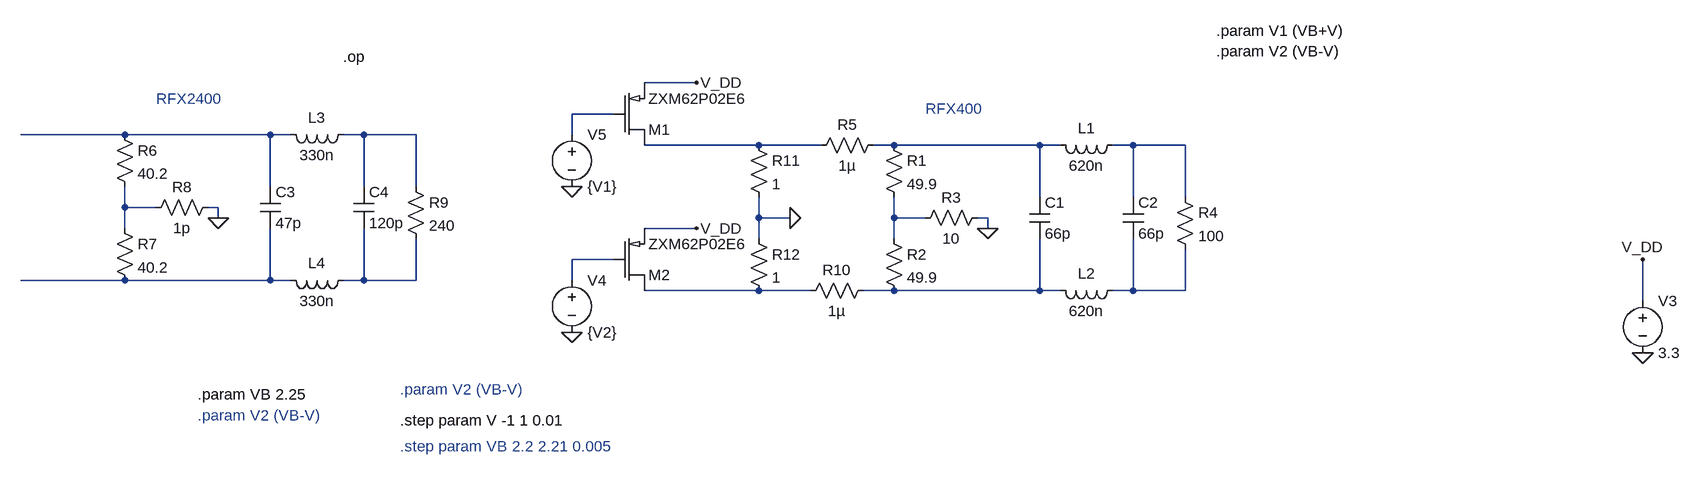
[diagram p0: schematic tr-RFX.asc]
tr-RFX.asc, the LTspice schematic file:
Version 4
SHEET 1 1008 760
WIRE -512 48 -592 48
WIRE -640 96 -704 96
WIRE -1392 128 -1552 128
WIRE -1168 128 -1392 128
WIRE -1136 128 -1168 128
WIRE -1024 128 -1056 128
WIRE -944 128 -1024 128
WIRE -704 128 -704 96
WIRE -416 144 -592 144
WIRE -320 144 -416 144
WIRE -208 144 -240 144
WIRE 16 144 -208 144
WIRE 48 144 16 144
WIRE 160 144 128 144
WIRE 240 144 160 144
WIRE -1168 208 -1168 128
WIRE -1024 208 -1024 128
WIRE -944 208 -944 128
WIRE 16 224 16 144
WIRE 160 224 160 144
WIRE 240 224 240 144
WIRE -1392 240 -1392 208
WIRE -1344 240 -1392 240
WIRE -1248 240 -1264 240
WIRE -1248 256 -1248 240
WIRE -416 256 -416 224
WIRE -368 256 -416 256
WIRE -208 256 -208 224
WIRE -160 256 -208 256
WIRE -64 256 -80 256
WIRE -1392 272 -1392 240
WIRE -512 272 -592 272
WIRE -64 272 -64 256
WIRE -416 288 -416 256
WIRE -208 288 -208 256
WIRE -640 320 -704 320
WIRE -1392 352 -1552 352
WIRE -1168 352 -1168 272
WIRE -1168 352 -1392 352
WIRE -1136 352 -1168 352
WIRE -1024 352 -1024 272
WIRE -1024 352 -1056 352
WIRE -944 352 -944 288
WIRE -944 352 -1024 352
WIRE -704 352 -704 320
WIRE -416 368 -592 368
WIRE -336 368 -416 368
WIRE -208 368 -256 368
WIRE 16 368 16 288
WIRE 16 368 -208 368
WIRE 48 368 16 368
WIRE 160 368 160 288
WIRE 160 368 128 368
WIRE 240 368 240 304
WIRE 240 368 160 368
WIRE 944 384 944 320
FLAG -64 272 0
FLAG -1248 256 0
FLAG 944 464 0
FLAG 944 320 V_DD
FLAG -512 272 V_DD
FLAG -512 48 V_DD
FLAG -704 432 0
FLAG -704 208 0
FLAG -368 256 0
SYMBOL res -224 128 R0
SYMATTR InstName R1
SYMATTR Value 49.9
SYMBOL res -224 272 R0
SYMATTR InstName R2
SYMATTR Value 49.9
SYMBOL res -176 272 R270
WINDOW 0 32 56 VTop 0
WINDOW 3 0 56 VBottom 0
SYMATTR InstName R3
SYMATTR Value 10
SYMBOL res 224 208 R0
SYMATTR InstName R4
SYMATTR Value 100
SYMBOL cap 0 224 R0
SYMATTR InstName C1
SYMATTR Value 66p
SYMBOL cap 144 224 R0
SYMATTR InstName C2
SYMATTR Value 66p
SYMBOL ind 144 128 R90
WINDOW 0 5 56 VBottom 0
WINDOW 3 32 56 VTop 0
SYMATTR InstName L1
SYMATTR Value 620n
SYMBOL ind 144 352 R90
WINDOW 0 5 56 VBottom 0
WINDOW 3 32 56 VTop 0
SYMATTR InstName L2
SYMATTR Value 620n
SYMBOL res -1408 112 R0
SYMATTR InstName R6
SYMATTR Value 40.2
SYMBOL res -1408 256 R0
SYMATTR InstName R7
SYMATTR Value 40.2
SYMBOL res -1360 256 R270
WINDOW 0 32 56 VTop 0
WINDOW 3 0 56 VBottom 0
SYMATTR InstName R8
SYMATTR Value 1p
SYMBOL res -960 192 R0
SYMATTR InstName R9
SYMATTR Value 240
SYMBOL cap -1184 208 R0
SYMATTR InstName C3
SYMATTR Value 47p
SYMBOL cap -1040 208 R0
SYMATTR InstName C4
SYMATTR Value 120p
SYMBOL ind -1040 112 R90
WINDOW 0 5 56 VBottom 0
WINDOW 3 32 56 VTop 0
SYMATTR InstName L3
SYMATTR Value 330n
SYMBOL ind -1040 336 R90
WINDOW 0 5 56 VBottom 0
WINDOW 3 32 56 VTop 0
SYMATTR InstName L4
SYMATTR Value 330n
SYMBOL PMOSbook -608 96 R0
SYMATTR Value ZXM62P02E6
SYMATTR InstName M1
SYMBOL PMOSbook -608 320 R0
SYMATTR Value ZXM62P02E6
SYMATTR InstName M2
SYMBOL voltage 944 368 R0
SYMATTR InstName V3
SYMATTR Value 3.3
SYMBOL voltage -704 336 R0
SYMATTR InstName V4
SYMATTR Value {V2}
SYMBOL voltage -704 112 R0
SYMATTR InstName V5
SYMATTR Value {V1}
SYMBOL res -224 128 R90
WINDOW 0 0 56 VBottom 0
WINDOW 3 32 56 VTop 0
SYMATTR InstName R5
SYMATTR Value 1µ
SYMBOL res -240 352 R90
WINDOW 0 0 56 VBottom 0
WINDOW 3 32 56 VTop 0
SYMATTR InstName R10
SYMATTR Value 1µ
SYMBOL res -432 128 R0
SYMATTR InstName R11
SYMATTR Value 1
SYMBOL res -432 272 R0
SYMATTR InstName R12
SYMATTR Value 1
TEXT -160 88 Left 0 ;RFX400
TEXT 288 -32 Left 0 !.param V1 (VB+V)\n.param V2 (VB-V)
TEXT -1280 560 Left 0 ;.param V2 (VB-V)
TEXT -968 568 Left 0 !.step param V -1 1 0.01
TEXT -1344 72 Left 0 ;RFX2400
TEXT -1056 8 Left 0 !.op
TEXT -1280 528 Left 0 !.param VB 2.25
TEXT -968 608 Left 0 ;.step param VB 2.2 2.21 0.005
TEXT -968 520 Left 0 ;.param V2 (VB-V)

The netlist it stands for:
* tr-RFX.asc
R1 N005 N008 49.9
R2 N008 N013 49.9
R3 N008 0 10
R4 N006 N014 100
C1 N005 N013 66p
C2 N006 N014 66p
L1 N006 N005 620n
L2 N014 N013 620n
R6 N002 N007 40.2
R7 N007 N010 40.2
R8 N007 0 1p
R9 N003 N011 240
C3 N002 N010 47p
C4 N003 N011 120p
L3 N003 N002 330n
L4 N011 N010 330n
M1 N004 N001 V_DD V_DD ZXM62P02E6
M2 N012 N009 V_DD V_DD ZXM62P02E6
V3 V_DD 0 3.3
V4 N009 0 {V2}
V5 N001 0 {V1}
R5 N005 N004 1µ
R10 N013 N012 1µ
R11 N004 0 1
R12 0 N012 1
.model NMOS NMOS
.model PMOS PMOS
.lib standard.mos
* RFX400
.param V1 (VB+V)
.param V2 (VB-V)
* .param V2 (VB-V)
.step param V -1 1 0.01
* RFX2400
.op
.param VB 2.25
* .step param VB 2.2 2.21 0.005
* .param V2 (VB-V)
.backanno
.end